# Altium schematic sheet JDQV1.1.SchDoc
size A3; SheetNumber: 1; SheetTotal: 3
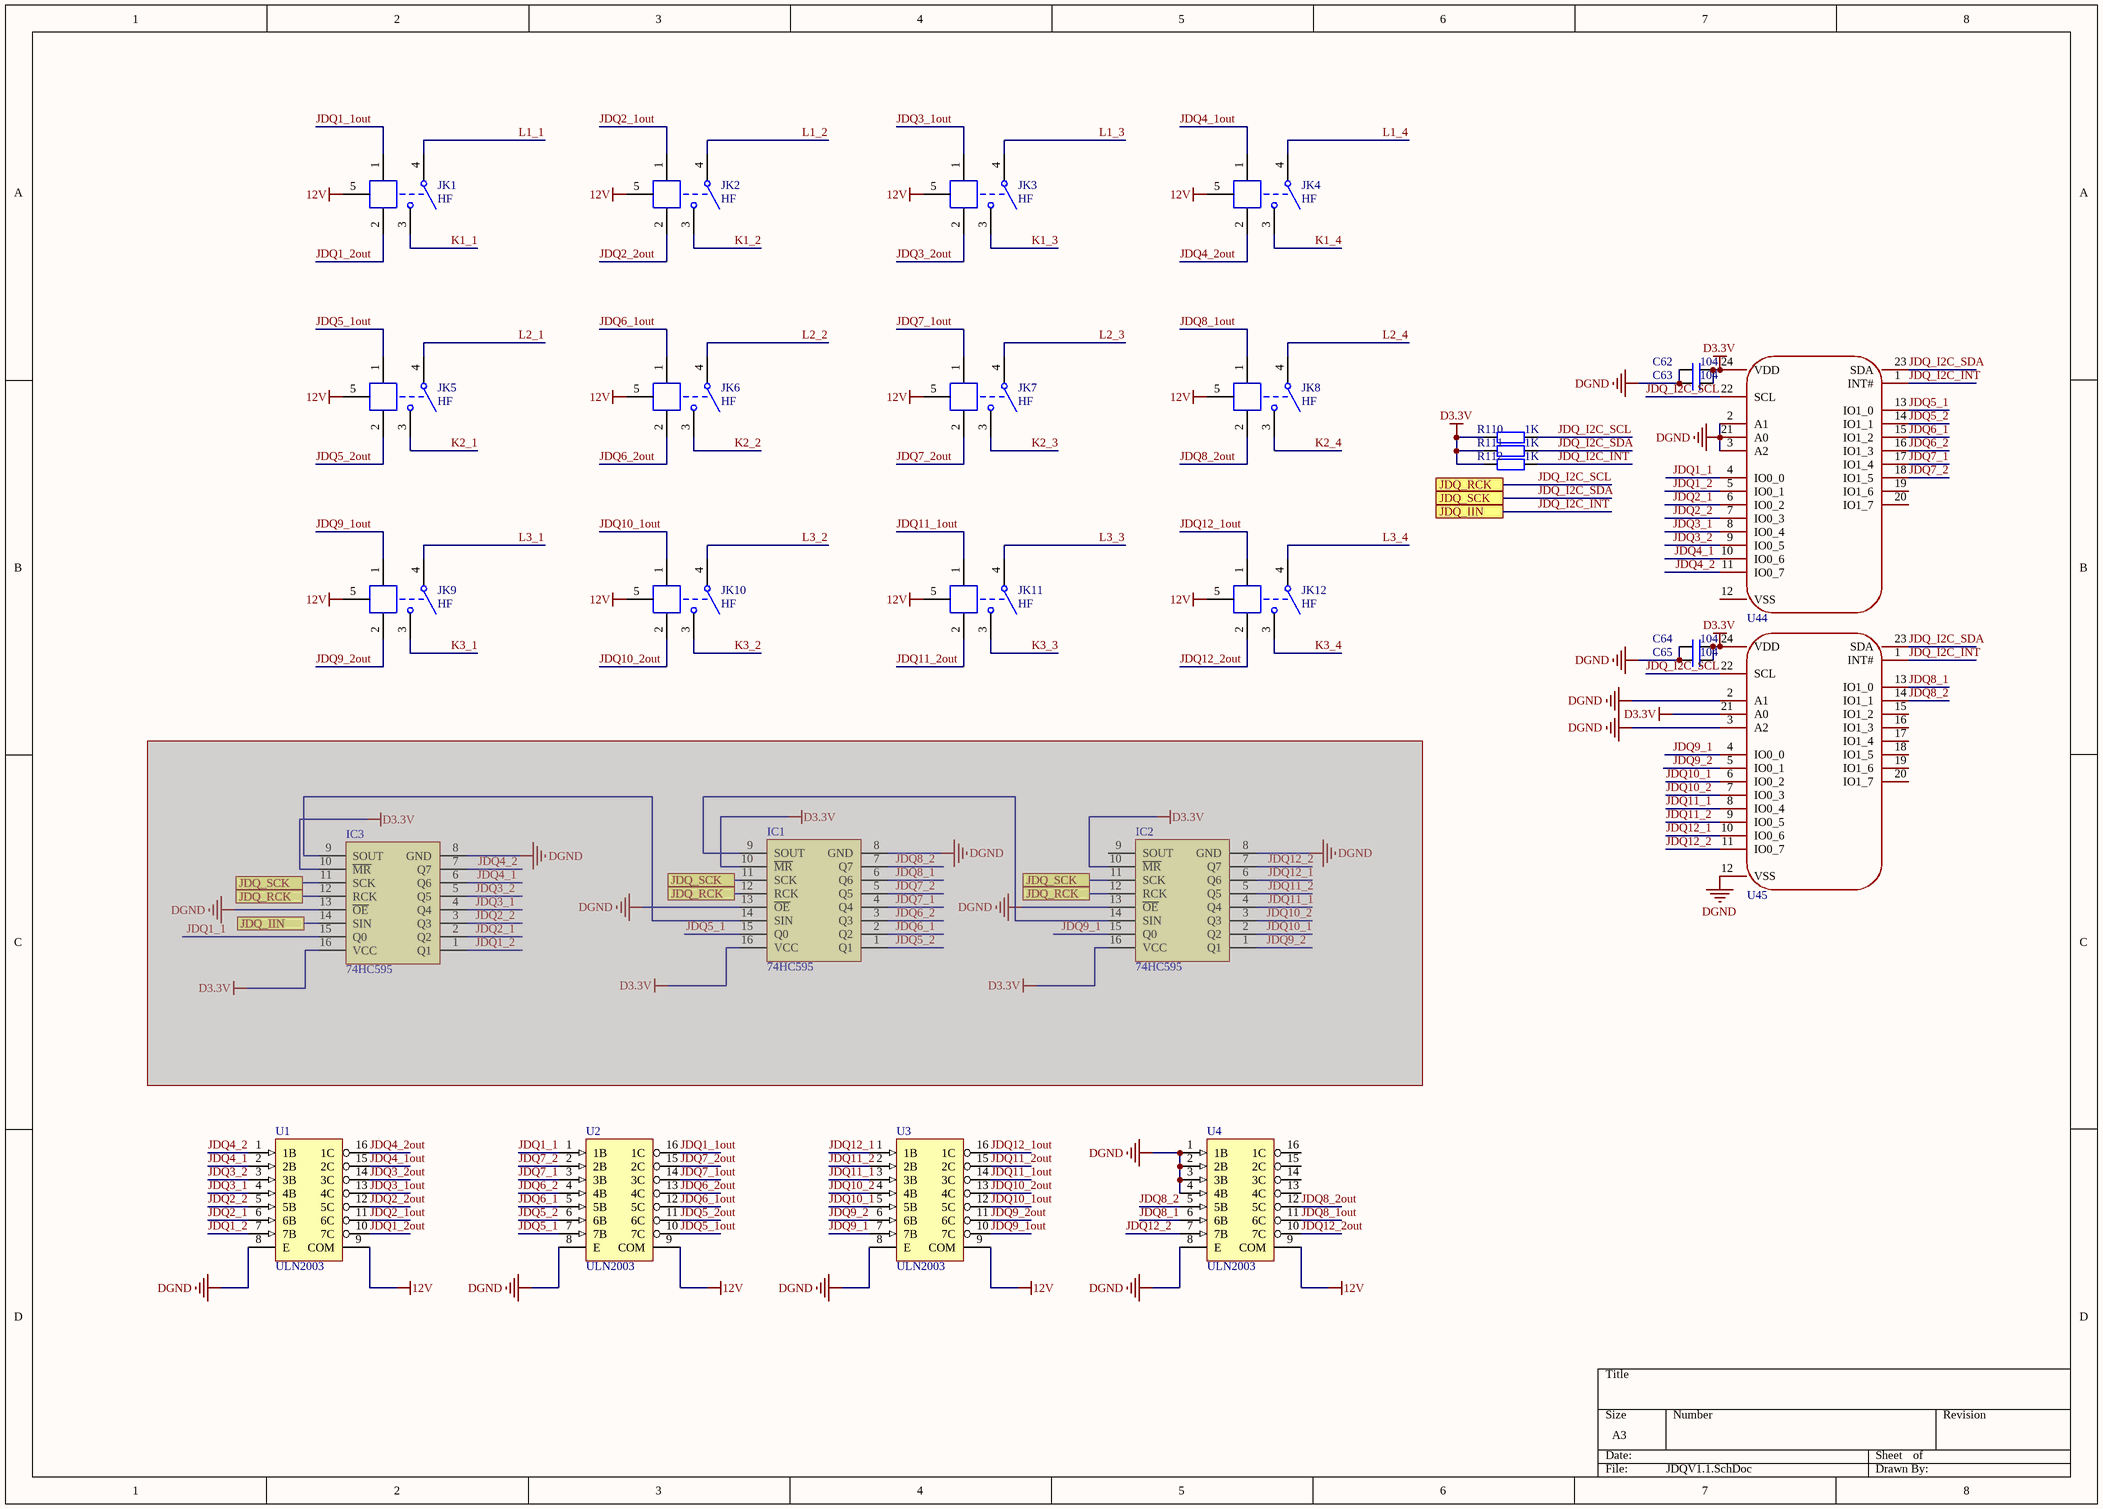
[diagram p0: JDQV1.1.SchDoc]

## Parts
C62  104  [C 0603_L]
C63  104  [C 0603_L]
C64  104  [C 0603_L]
C65  104  [C 0603_L]
IC1  74HC595  [SOP16_N]  (masked out: inside a compile mask, not in the netlist)
IC2  74HC595  [SOP16_N]  (masked out: inside a compile mask, not in the netlist)
IC3  74HC595  [SOP16_N]  (masked out: inside a compile mask, not in the netlist)
JK1  HF  [HF163F-L16]
JK2  HF  [HF163F-L16]
JK3  HF  [HF163F-L16]
JK4  HF  [HF163F-L16]
JK5  HF  [HF163F-L16]
JK6  HF  [HF163F-L16]
JK7  HF  [HF163F-L16]
JK8  HF  [HF163F-L16]
JK9  HF  [HF163F-L16]
JK10  HF  [HF163F-L16]
JK11  HF  [HF163F-L16]
JK12  HF  [HF163F-L16]
R110  1K  [R 0603_L]
R111  1K  [R 0603_L]
R112  1K  [R 0603_L]
U1  ULN2003  [SOP16_M]
U2  ULN2003  [SOP16_M]
U3  ULN2003  [SOP16_M]
U4  ULN2003  [SOP16_M]
U44  PCA9555PW,118  [TSSOP-24]  (value not drawn)
U45  PCA9555PW,118  [TSSOP-24]  (value not drawn)

## Ports
JDQ_IIN, JDQ_RCK, JDQ_SCK

## Nets
12V: JK1.5(G) JK2.5(G) JK3.5(G) JK4.5(G) JK5.5(G) JK6.5(G) JK7.5(G) JK8.5(G) JK9.5(G) JK10.5(G) JK11.5(G) JK12.5(G) U1.9(COM) U2.9(COM) U3.9(COM) U4.9(COM)
D3.3V: C62.2 C63.2 C64.2 C65.2 R110.1 R111.1 R112.1 U44.24(VDD) U45.21(A0) U45.24(VDD)
DGND: C62.1 C63.1 C64.1 C65.1 U1.8(E) U2.8(E) U3.8(E) U4.1(1B) U4.2(2B) U4.3(3B) U4.4(4B) U4.8(E) U44.2(A1) U44.3(A2) U44.21(A0) U45.2(A1) U45.3(A2) U45.12(VSS)
JDQ1_1: U2.1(1B) U44.4(IO0_0)
JDQ1_1out: JK1.1 U2.16(1C)
JDQ1_2: U1.7(7B) U44.5(IO0_1)
JDQ1_2out: JK1.2 U1.10(7C)
JDQ2_1: U1.6(6B) U44.6(IO0_2)
JDQ2_1out: JK2.1 U1.11(6C)
JDQ2_2: U1.5(5B) U44.7(IO0_3)
JDQ2_2out: JK2.2 U1.12(5C)
JDQ3_1: U1.4(4B) U44.8(IO0_4)
JDQ3_1out: JK3.1 U1.13(4C)
JDQ3_2: U1.3(3B) U44.9(IO0_5)
JDQ3_2out: JK3.2 U1.14(3C)
JDQ4_1: U1.2(2B) U44.10(IO0_6)
JDQ4_1out: JK4.1 U1.15(2C)
JDQ4_2: U1.1(1B) U44.11(IO0_7)
JDQ4_2out: JK4.2 U1.16(1C)
JDQ5_1: U2.7(7B) U44.13(IO1_0)
JDQ5_1out: JK5.1 U2.10(7C)
JDQ5_2: U2.6(6B) U44.14(IO1_1)
JDQ5_2out: JK5.2 U2.11(6C)
JDQ6_1: U2.5(5B) U44.15(IO1_2)
JDQ6_1out: JK6.1 U2.12(5C)
JDQ6_2: U2.4(4B) U44.16(IO1_3)
JDQ6_2out: JK6.2 U2.13(4C)
JDQ7_1: U2.3(3B) U44.17(IO1_4)
JDQ7_1out: JK7.1 U2.14(3C)
JDQ7_2: U2.2(2B) U44.18(IO1_5)
JDQ7_2out: JK7.2 U2.15(2C)
JDQ8_1: U4.6(6B) U45.13(IO1_0)
JDQ8_1out: JK8.1 U4.11(6C)
JDQ8_2: U4.5(5B) U45.14(IO1_1)
JDQ8_2out: JK8.2 U4.12(5C)
JDQ9_1: U3.7(7B) U45.4(IO0_0)
JDQ9_1out: JK9.1 U3.10(7C)
JDQ9_2: U3.6(6B) U45.5(IO0_1)
JDQ9_2out: JK9.2 U3.11(6C)
JDQ10_1: U3.5(5B) U45.6(IO0_2)
JDQ10_1out: JK10.1 U3.12(5C)
JDQ10_2: U3.4(4B) U45.7(IO0_3)
JDQ10_2out: JK10.2 U3.13(4C)
JDQ11_1: U3.3(3B) U45.8(IO0_4)
JDQ11_1out: JK11.1 U3.14(3C)
JDQ11_2: U3.2(2B) U45.9(IO0_5)
JDQ11_2out: JK11.2 U3.15(2C)
JDQ12_1: U3.1(1B) U45.10(IO0_6)
JDQ12_1out: JK12.1 U3.16(1C)
JDQ12_2: U4.7(7B) U45.11(IO0_7)
JDQ12_2out: JK12.2 U4.10(7C)
JDQ_I2C_INT: R112.2 U44.1(INT#) U45.1(INT#) ; port JDQ_IIN
JDQ_I2C_SCL: R110.2 U44.22(SCL) U45.22(SCL) ; port JDQ_RCK
JDQ_I2C_SDA: R111.2 U44.23(SDA) U45.23(SDA) ; port JDQ_SCK
K1_1: JK1.3
K1_2: JK2.3
K1_3: JK3.3
K1_4: JK4.3
K2_1: JK5.3
K2_2: JK6.3
K2_3: JK7.3
K2_4: JK8.3
K3_1: JK9.3
K3_2: JK10.3
K3_3: JK11.3
K3_4: JK12.3
L1_1: JK1.4
L1_2: JK2.4
L1_3: JK3.4
L1_4: JK4.4
L2_1: JK5.4
L2_2: JK6.4
L2_3: JK7.4
L2_4: JK8.4
L3_1: JK9.4
L3_2: JK10.4
L3_3: JK11.4
L3_4: JK12.4

Not connected (* = marked no-connect by the designer): U4 13(4C) 14(3C) 15(2C) 16(1C); U44 12(VSS) 19(IO1_6) 20(IO1_7); U45 15(IO1_2) 16(IO1_3) 17(IO1_4) 18(IO1_5) 19(IO1_6) 20(IO1_7)

## Library data of the parts
C62-C65 = C: 贴片电容; BOM名称: 无极性贴片电容; 淘宝ID: 封装库来自淘宝 ID：黄晶宝石; 联系售后，技术支持: https://shop463601444.taobao.com; 唯一出售店铺网址: https://shop463601444.taobao.com
IC1-IC3 = 74HC595: 8位移位寄存器; 版权归属: 源创客; BOM名称: 8位移位寄存器; 学习资源: www.ooocke.com
JK1-JK12 = HFE10: HF双线圈磁保持继电器
R110-R112 = R: 贴片电阻; 版权归属: 来自淘宝 ID：黄晶宝石; 封装库来自淘宝卖家 ID：黄晶宝石: 其他店铺购入均为盗版，不享受售后技术支持服务，请立即申请退款; BOM名称: 贴片电阻; 联系售后: https://shop463601444.taobao.com
U1-U4 = ULN2003-2: 达林顿驱动芯片; 版权归属: 源创客; BOM名称: 达林顿驱动芯片; 学习资源: www.ooocke.com
U44 U45 = PCA9555PW,118: 接口:I2C；SMBus;I/O数量:16;时钟频率:400kHz;; Manufacturer: NXP(恩智浦); Add into BOM: yes; Number of I/O: 16; Interrupt Output: 有中断输出; Output Type: 推挽式; Supply Voltage: 2.3V~5.5V; Output Source current: 10mA; Output Sink Current: 25mA; Clock Frequency: 400kHz; Symbol: PCA9555PW,118; Device: PCA9555PW,118; LCSC Part Name: 带中断的16位I2C总线和SMBus I/O端口; Supplier Part: C128392; Manufacturer Part: PCA9555PW,118; Supplier Footprint: TSSOP-24; JLCPCB Part Class: 扩展库; Datasheet: https://atta.szlcsc.com/upload/public/pdf/source/20170928/C133183_1506599719478995066.pdf; Supplier: LCSC; Convert to PCB: yes; Interface: I2C；SMBus; Operating Temperature: -40℃~+85℃